# Altium schematic sheet norbi_lm_pl_interface.SchDoc: Имя
size 209 x 297 mm; ApprovedBy: Утвердил; CheckedBy: Проверил; Author: Разработал; Organization: НГУ; DocumentNumber: Децимальный номер Э3; SheetNumber: Лист; SheetTotal: Листов; PageSetup: Record=PageOptions|CenterHorizontal=True|CenterVertical=True|PrintScale=1.00|XCorrection=1.00|YCorrection=1.00|PrintKind=1|BorderSize=5000000|LeftOffset=0|BottomOffset=0|Orientation=2|PaperLength=1000|PaperWidth=1000|Scale=100|PaperSource=15|PrintQuality=1200|MediaType=1|DitherType=10|PaperKind=A3|PrintScaleMode=1; Weight: -; ScaleFactor: -; NormInspection: Норм.Контр.
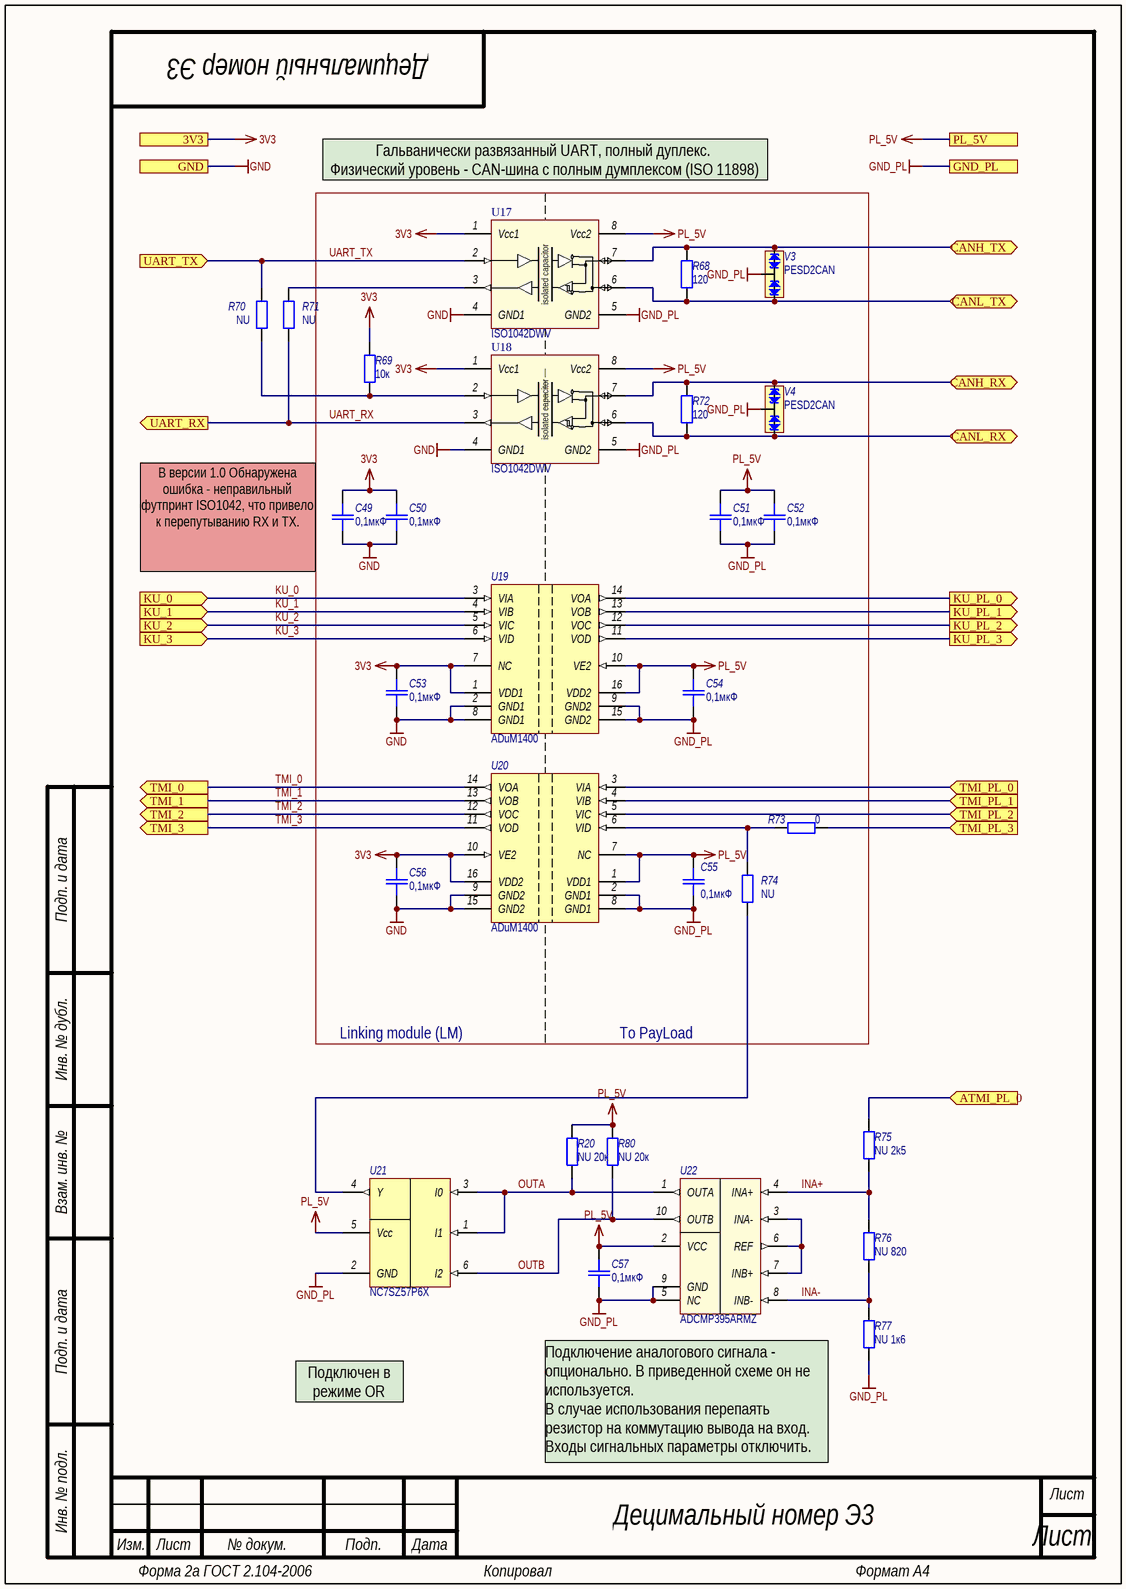
[diagram p0: norbi_lm_pl_interface.SchDoc]

## Parts
C49  0,1мкФ  [CR-0603]
C50  0,1мкФ  [CR-0603]
C51  0,1мкФ  [CR-0603]
C52  0,1мкФ  [CR-0603]
C53  0,1мкФ  [CR-0603]
C54  0,1мкФ  [CR-0603]
C55  0,1мкФ  [CR-0603]
C56  0,1мкФ  [CR-0603]
C57  0,1мкФ  [CR-0603]
R20  NU 20к  [CR-0603]
R68  120  [CR-0603]
R69  10к  [CR-0603]
R70  NU  [CR-0603]
R71  NU  [CR-0603]
R72  120  [CR-0603]
R73  0  [CR-0603]
R74  NU  [CR-0603]
R75  NU 2k5  [CR-0603]
R76  NU 820  [CR-0603]
R77  NU 1к6  [CR-0603]
R80  NU 20к  [CR-0603]
U17  Наименование: ISO1042DWV  [SOIC-8-WIDE]  (hidden comment: ISO1042)
U18  Наименование: ISO1042DWV  [SOIC-8-WIDE]  (hidden comment: ISO1042)
U19  ADuM1400  [SOIC-16-WIDE]
U20  ADuM1400  [SOIC-16-WIDE]
U21  NC7SZ57P6X  [SC70 6-Lead]
U22  ADCMP395ARMZ  [MSOP-10]
V3  PESD2CAN  [SOT-23]
V4  PESD2CAN  [SOT-23]

## Ports
3V3, ATMI_PL_0 (in), CANH_RX (bidir), CANH_TX (bidir), CANL_RX (bidir), CANL_TX (bidir), GND, GND_PL, KU_0 (in), KU_1 (in), KU_2 (in), KU_3 (in), KU_PL_0 (out), KU_PL_1 (out), KU_PL_2 (out), KU_PL_3 (out), PL_5V, TMI_0 (out), TMI_1 (out), TMI_2 (out), TMI_3 (out), TMI_PL_0 (in), TMI_PL_1 (in), TMI_PL_2 (in), TMI_PL_3 (in), UART_RX (out), UART_TX (in)

## Nets
3V3: C49.2 C50.2 C53.2 C56.2 R69.1 U17.1(Vcc1) U18.1(Vcc1) U19.1(VDD1) U19.7(NC) U20.10(VE2) U20.16(VDD2) ; port 3V3
GND: C49.1 C50.1 C53.1 C56.1 U17.4(GND1) U18.4(GND1) U19.2(GND1) U19.8(GND1) U20.9(GND2) U20.15(GND2) ; port GND
GND_PL: C51.1 C52.1 C54.1 C55.1 C57.1 R77.1 U17.5(GND2) U18.5(GND2) U19.9(GND2) U19.15(GND2) U20.2(GND1) U20.8(GND1) U21.2(GND) U22.5(NC) U22.9(GND) V3.3(CC) V4.3(CC) ; port GND_PL
PL_5V: C51.2 C52.2 C54.2 C55.2 C57.2 R20.2 R80.2 U17.8(Vcc2) U18.8(Vcc2) U19.10(VE2) U19.16(VDD2) U20.1(VDD1) U20.7(NC) U21.5(Vcc) U22.2(VCC) ; port PL_5V
ATMI_PL_0: R75.2 ; port ATMI_PL_0
CANH_RX: R72.2 U18.7(CANH) V4.1(C1) ; port CANH_RX
CANH_TX: R68.2 U17.7(CANH) V3.1(C1) ; port CANH_TX
CANL_RX: R72.1 U18.6(CANL) V4.2(C2) ; port CANL_RX
CANL_TX: R68.1 U17.6(CANL) V3.2(C2) ; port CANL_TX
INA+: R75.1 R76.2 U22.4(INA+)
INA-: R76.1 R77.2 U22.8(INB-)
KU_0: U19.3(VIA) ; port KU_0
KU_1: U19.4(VIB) ; port KU_1
KU_2: U19.5(VIC) ; port KU_2
KU_3: U19.6(VID) ; port KU_3
KU_PL_0: U19.14(VOA) ; port KU_PL_0
KU_PL_1: U19.13(VOB) ; port KU_PL_1
KU_PL_2: U19.12(VOC) ; port KU_PL_2
KU_PL_3: U19.11(VOD) ; port KU_PL_3
OUTA: R20.1 U21.1(I1) U21.3(I0) U22.1(OUTA)
OUTB: R80.1 U21.6(I2) U22.10(OUTB)
TMI_0: U20.14(VOA) ; port TMI_0
TMI_1: U20.13(VOB) ; port TMI_1
TMI_2: U20.12(VOC) ; port TMI_2
TMI_3: U20.11(VOD) ; port TMI_3
TMI_PL_0: U20.3(VIA) ; port TMI_PL_0
TMI_PL_1: U20.4(VIB) ; port TMI_PL_1
TMI_PL_2: U20.5(VIC) ; port TMI_PL_2
TMI_PL_3: R73.1 ; port TMI_PL_3
UART_RX: R71.1 U18.3(RXD) ; port UART_RX
UART_TX: R70.2 U17.2(TXD) ; port UART_TX
NetR69_2: R69.2 R70.1 U18.2(TXD)
NetR71_2: R71.2 U17.3(RXD)
NetR73_2: R73.2 R74.2 U20.6(VID)
NetR74_1: R74.1 U21.4(Y)
NetU22_3: U22.3(INA-) U22.6(REF) U22.7(INB+)

## Notes on the sheet
- Гальванически развязанный UART, полный дуплекс.
  Физический уровень - CAN-шина с полным думплексом (ISO 11898)
- (near C49) В версии 1.0 Обнаружена ошибка - неправильный футпринт ISO1042, что привело к перепутыванию RX и TX.
- Linking module (LM)
- To PayLoad
- Подключен в режиме OR
- Подключение аналогового сигнала - опционально. В приведенной схеме он не используется.
  В случае использования перепаять резистор на коммутацию вывода на вход. Входы сигнальных параметры отключить.
- Подп. и дата
- Инв. № дубл.
- Взам. инв. №
- Инв. № подл.
- Изм.
- Лист
- № докум.
- Подп.
- Дата
- Форма 2а ГОСТ 2.104-2006
- Копировал
- Формат А4
- (in symbol ISO1042) isolated capacitor

## Library data of the parts
C49-C57 = C_smd: Конденсатор для поверхностного монтажа; Назначение: Чип-конденсатор; Потребление, Вт: 0; Наименование: SMD-0603; Value: 0,1мкФ
R20 R69-R71 R73 R74 R80 = R_smd: Резистор для поверхностного монтажа; Наименование: SMD-0603 20%; Назначение: Чип-резистор; Потребление, Вт: 0,001
  R20 R80: Value: NU 20к
  R69: Value: 10к
  R70 R71 R74: Value: NU
  R73: Value: 0
R68 R72 R75-R77 = R_smd: Резистор для поверхностного монтажа; Наименование: SMD-0603 1%; Назначение: Чип-резистор; Потребление, Вт: 0,001
  R68 R72: Value: 120
  R75: Value: NU 2k5; Parameter 1: *
  R76: Value: NU 820; Parameter 1: *
  R77: Value: NU 1к6; Parameter 1: *
U17 U18 = ISO1042: Isolated CAN Transceiver; Назначение: Изолированный CAN приемник; Потребление, Вт: 0,001
U19 U20 = ADuM1400: Quad Channel Digital Isolator, 2.5 KV rms Insulation Rating; Назначение: 4-канальный цифровой изолятор; Потребление, Вт: 0,025; Наименование: ADuM1400
U21 = NC7SZ57: Universal Configurable 2-Input / Logic Gates; Потребление, Вт: 0,001; Value: NU; Назначение: Universal Configurable 2-Input; Наименование: NC7SZ57P6X
U22 = ADCMP395: Dual Comparators with Accurate Reference Output; Потребление, Вт: 0,001; Value: NU; Назначение: Dual Comparators with Accurate Reference Output; Наименование: ADCMP395ARMZ; ComponentLink1Description: Datasheet; ComponentLink1URL: https://www.analog.com/en/products/adcmp395.html
V3 V4 = PESD2CAN: CAN bus ESD protection diode; Назначение: Защитная диодная сборка CAN-шины от ЭСР; Потребление, Вт: 0,001; Наименование: PESD2CAN